# EAGLE board MSP-EXP430FR5994_EagleCAD (EAGLE 7.2.0)
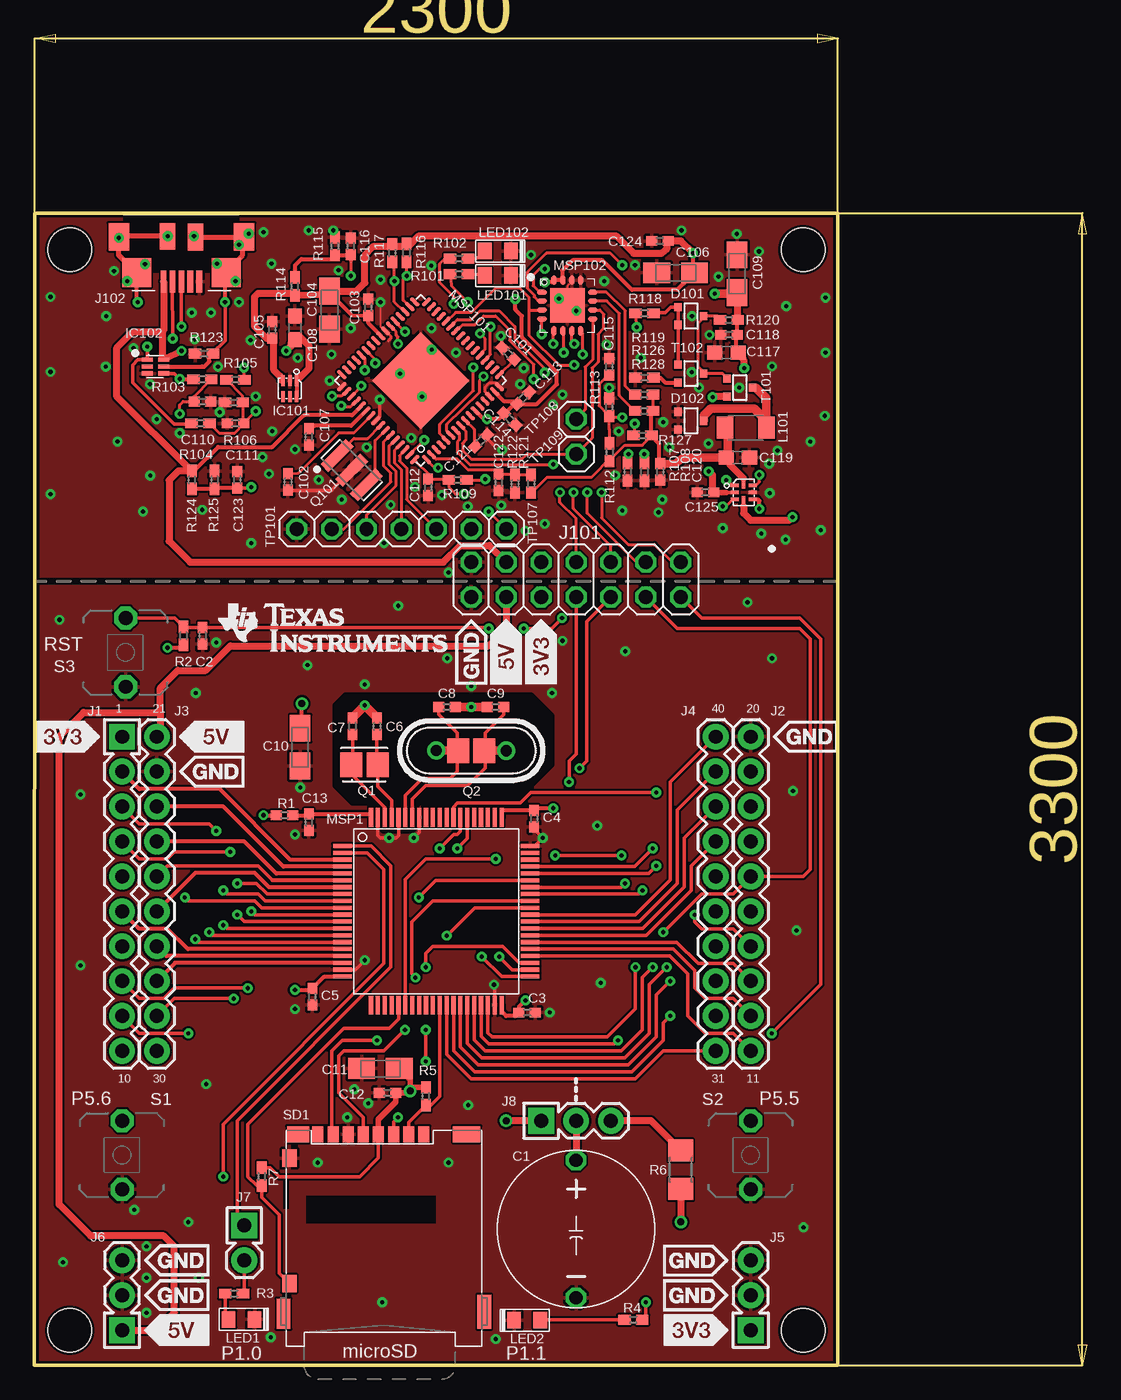
[diagram p7: board, top side]
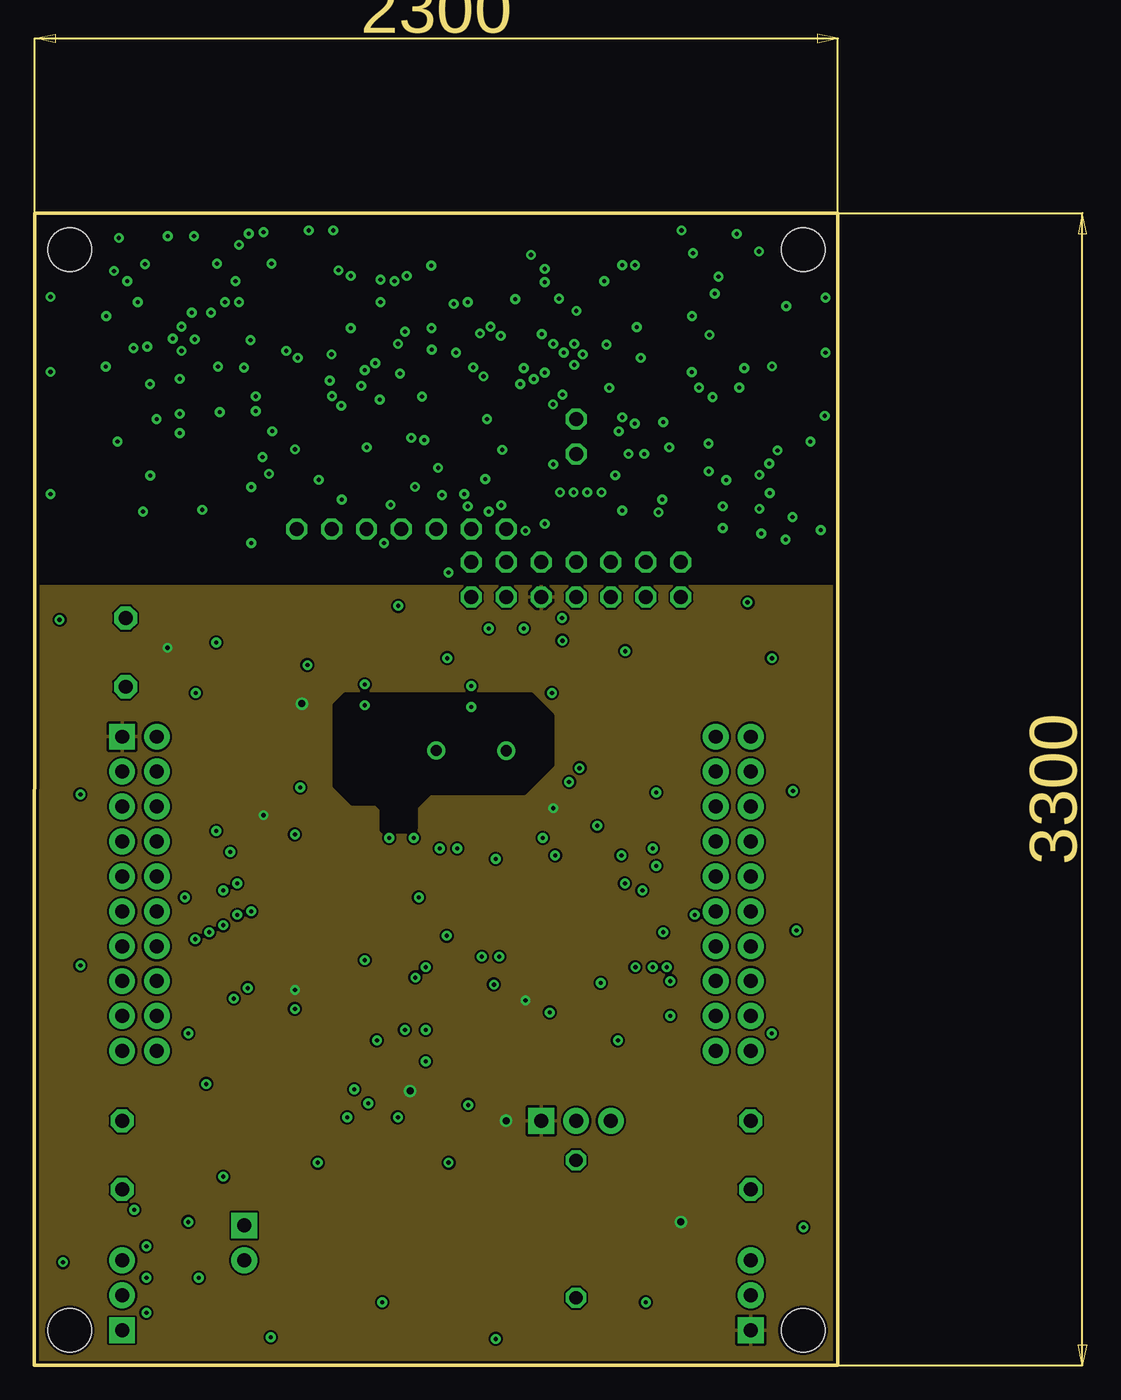
[diagram p8: board, inner layer MidTop]
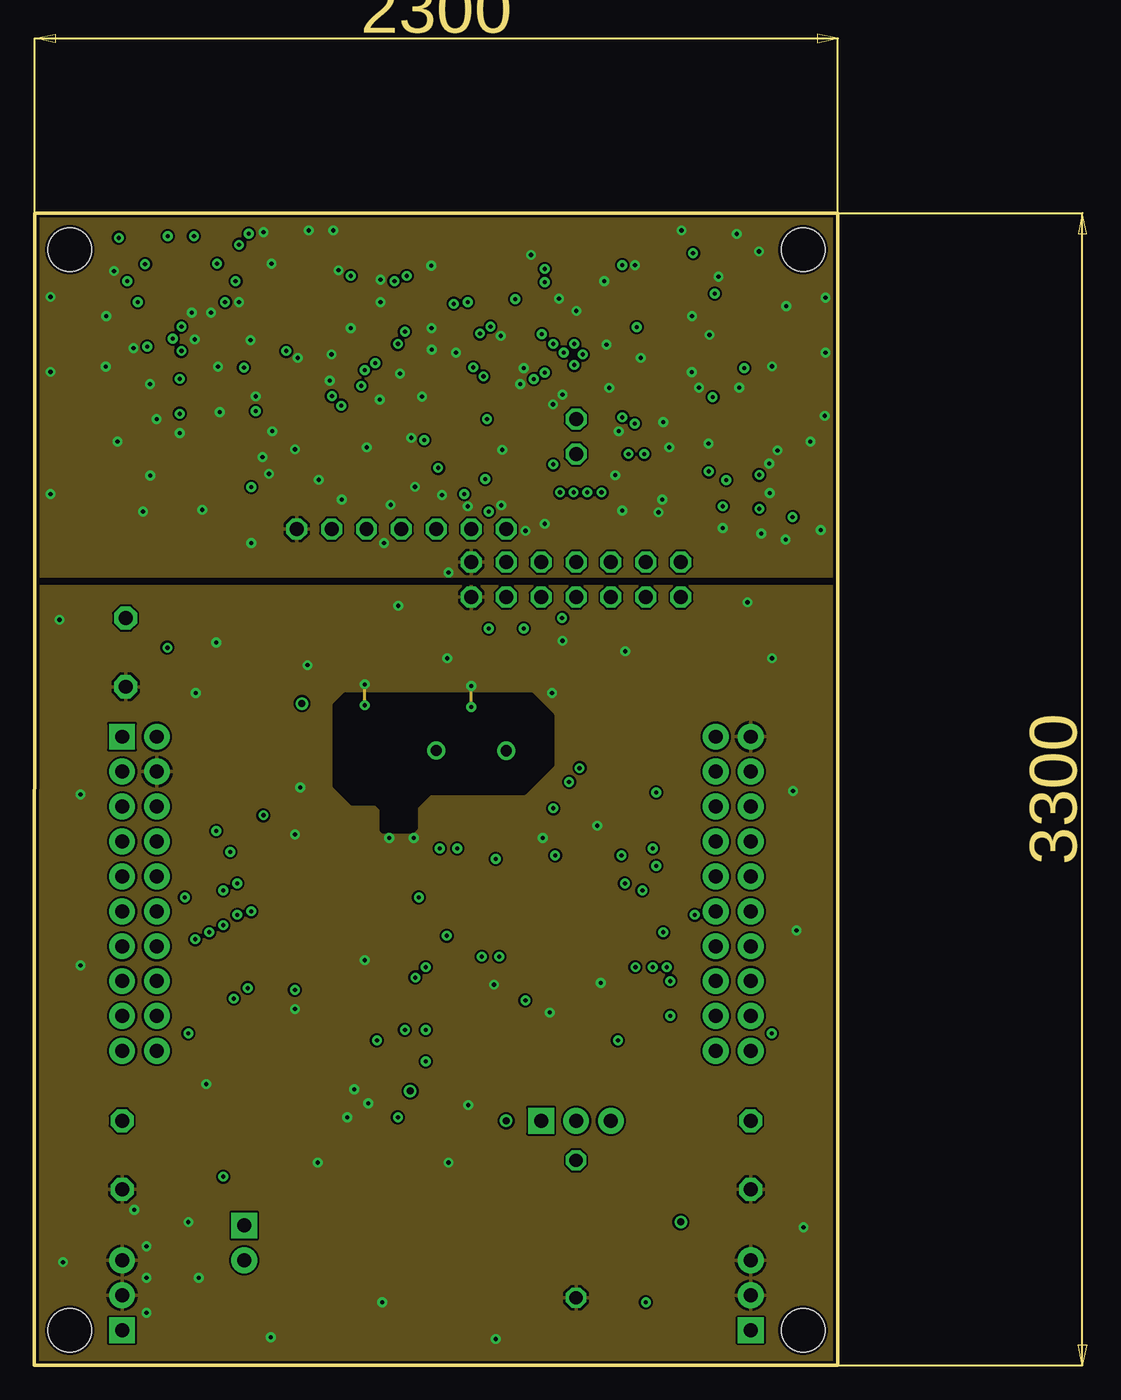
[diagram p9: board, inner layer MidBottom]
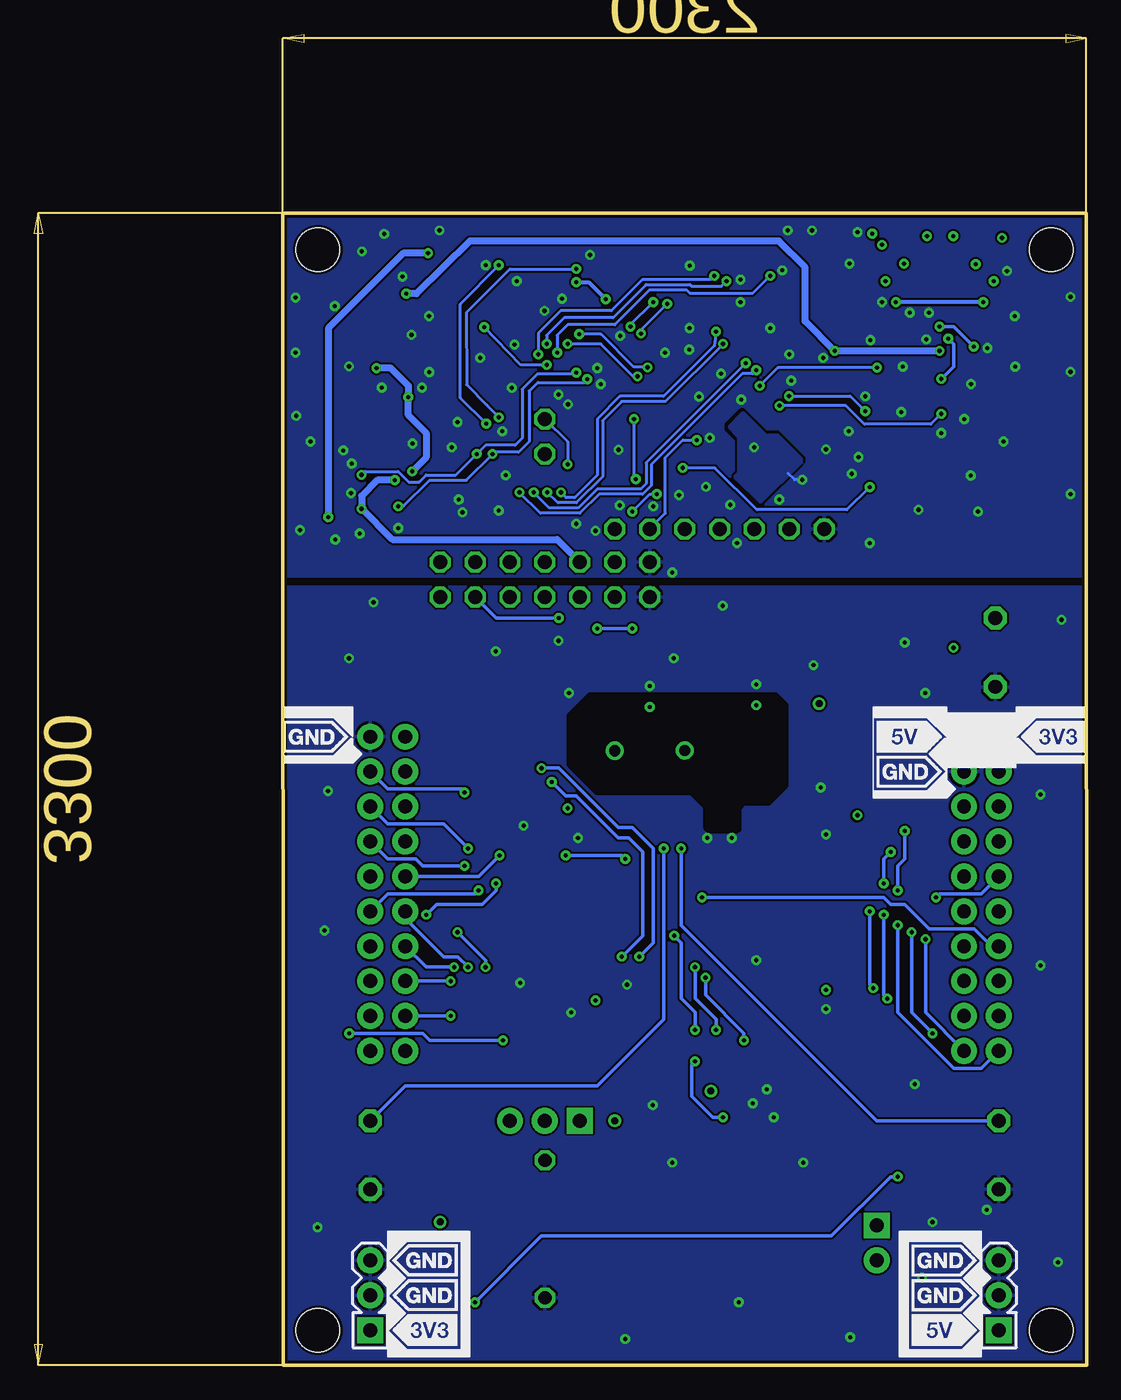
[diagram p10: board, bottom side, seen from below]

Size 58.45 x 83.82 mm. Coordinates in mm from the lower left corner, seen from the top.
Outline: 0,0 58.42,0 58.45,83.82 0.02,83.82 0,0
Copper layers (1+2*15+16): Top 0.0178mm / dielectric 12mil / MidTop 0.0356mm / dielectric 27mil / MidBottom 0.0356mm / dielectric 12mil / Bottom 0.0178mm
Design rules "MSP430 PCBExpress 4-layer-Stein": minimum track width 6mil, minimum drill 12mil, track to track 6mil, track to pad 6mil, pad to pad 6mil, via to via 8mil, smd to smd 6mil, copper to edge 8mil, drill to drill 8mil, minimum pad ring 10mil, minimum via ring 8mil, stop-mask expansion 8mil, vias tented up to drill 15mil, thermal gap 8mil
Net classes: 0 default: width 0.254 mm; 1 Ground: width 0.305 mm, drill 0.305 mm, clearance 0.152 mm to class 0, clearance 0.152 mm; 2 Power: width 0.406 mm, drill 0.305 mm, clearance 0.152 mm to class 0, clearance 0.152 mm to class 1, clearance 0.152 mm
tRestrict: area 20.5,62.5 to 26.3,69.6
bRestrict: area 20.5,62.5 to 26.3,69.6

## Footprints (pad centres in the part's own frame; a part is rotated, then mirrored left to right if it is on the bottom)
PANASONIC_SUPERCAP = drill 0.965 octagon: + 0,5; - 0,-5
0402 = smd 0.8 x 0.7: 1 -0.6,0; 2 0.6,0
A/3216-18R = smd 1.95 x 1.5: + 1.375,0; - -1.375,0
C0603 = smd 1.1 x 1: 1 -0.85,0; 2 0.85,0
SOT323 = smd 0.6 x 0.55: 1 -0.65,-0.825; 2 0.65,-0.825; 3 0,1.025
WSON_DSE = smd 0.25 x 0.8: 1 0,0; 2 0.5,0; 3 1,0; 5 0.5,1.15; 6 0,1.15; P4 1,1.15
SON(DRY)6 = smd 0.81 x 0.305: 1 -0.1,0; 2 -0.1,-0.5; 3 -0.1,-1; 4 1.1,-1; 5 1.1,-0.5; 6 1.1,0
UQFN_RSE = smd 0.25 x 0.58: 1 -0.5,-0.65; 2 0,-0.65; 3 0.5,-0.65; 5 0.5,0.65; 6 0,0.65; 7 -0.5,0.65 | smd 0.58 x 0.25: 4 0.55,0; 8 -0.55,0
J1 = drill 1.016 pad 1.88 square: 1 0,22.86 | drill 1.016 pad 1.88: 2 0,20.32; 3 0,17.78; 4 0,15.24; 5 0,12.7; 6 0,10.16; 7 0,7.62; 8 0,5.08; 9 0,2.54; 10 0,0
J2 = drill 1.016 pad 1.88: 11 0,0; 12 0,2.54; 13 0,5.08; 14 0,7.62; 15 0,10.16; 16 0,12.7; 17 0,15.24; 18 0,17.78; 19 0,20.32; 20 0,22.86
J3 = drill 1.016 pad 1.88: 21 0,22.86; 22 0,20.32; 23 0,17.78; 24 0,15.24; 25 0,12.7; 26 0,10.16; 27 0,7.62; 28 0,5.08; 29 0,2.54; 30 0,0
J4 = drill 1.016 pad 1.88: 31 0,0; 32 0,2.54; 33 0,5.08; 34 0,7.62; 35 0,10.16; 36 0,12.7; 37 0,15.24; 38 0,17.78; 39 0,20.32; 40 0,22.86
3PIN_PWR_3V3 = drill 1.016 pad 1.88 square: 1 0,0 | drill 1.016 pad 1.88: 2 0,2.54; 3 0,5.08
3PIN_PWR_5V = drill 1.016 pad 1.88 square: 1 0,0 | drill 1.016 pad 1.88: 2 0,2.54; 3 0,5.08
1X02 = drill 1.016 pad 1.88 square: 1 -1.27,0 | drill 1.016 pad 1.88: 2 1.27,0
1X03 = drill 1.016 pad 1.88 square: 1 0,0 | drill 1.016 pad 1.88: 2 2.54,0; 3 5.08,0
J101 = drill 1.016 octagon: 1 7.62,1.27; 2 7.62,-1.27; 3 5.08,1.27; 4 5.08,-1.27; 5 2.54,1.27; 6 2.54,-1.27; 7 0,1.27; 8 0,-1.27; 9 -2.54,1.27; 10 -2.54,-1.27; 11 -5.08,1.27; 12 -5.08,-1.27; 13 -7.62,1.27; 14 -7.62,-1.27
EZFET_UX62M-B-5P = smd 0.42 x 1.6: 1 1.3,1.3; 2 0.65,1.3; 3 0,1.3; 4 -0.65,1.3; 5 -1.3,1.3 | smd 2.1 x 2.1: S1 -3.25,0.65; S2 3.25,0.65 | smd 1.5 x 2: S3 -4.55,-1.95; S4 4.55,-1.95 | smd 1.144 x 1.949: S5 -1.016,-1.93; S6 1.016,-1.981
L3216C = smd 1.2 x 1.6: 1 -1.5,0; 2 1.5,0
LED0805 = smd 1 x 1.2: A 1.052,0.102; C -0.848,0.102
PN80 = smd 1.35 x 0.3: 1 -6.825,4.75; 2 -6.825,4.25; 3 -6.825,3.75; 4 -6.825,3.25; 5 -6.825,2.75; 6 -6.825,2.25; 7 -6.825,1.75; 8 -6.825,1.25; 9 -6.825,0.75; 10 -6.825,0.25; 11 -6.825,-0.25; 12 -6.825,-0.75; 13 -6.825,-1.25; 14 -6.825,-1.75; 15 -6.825,-2.25; 16 -6.825,-2.75; 17 -6.825,-3.25; 18 -6.825,-3.75; 19 -6.825,-4.25; 20 -6.825,-4.75; 41 6.825,-4.75; 42 6.825,-4.25; 43 6.825,-3.75; 44 6.825,-3.25; 45 6.825,-2.75; 46 6.825,-2.25; 47 6.825,-1.75; 48 6.825,-1.25; 49 6.825,-0.75; 50 6.825,-0.25; 51 6.825,0.25; 52 6.825,0.75; 53 6.825,1.25; 54 6.825,1.75; 55 6.825,2.25; 56 6.825,2.75; 57 6.825,3.25; 58 6.825,3.75; 59 6.825,4.25; 60 6.825,4.75 | smd 0.3 x 1.35: 21 -4.75,-6.825; 22 -4.25,-6.825; 23 -3.75,-6.825; 24 -3.25,-6.825; 25 -2.75,-6.825; 26 -2.25,-6.825; 27 -1.75,-6.825; 28 -1.25,-6.825; 29 -0.75,-6.825; 30 -0.25,-6.825; 31 0.25,-6.825; 32 0.75,-6.825; 33 1.25,-6.825; 34 1.75,-6.825; 35 2.25,-6.825; 36 2.75,-6.825; 37 3.25,-6.825; 38 3.75,-6.825; 39 4.25,-6.825; 40 4.75,-6.825; 61 4.75,6.825; 62 4.25,6.825; 63 3.75,6.825; 64 3.25,6.825; 65 2.75,6.825; 66 2.25,6.825; 67 1.75,6.825; 68 1.25,6.825; 69 0.75,6.825; 70 0.25,6.825; 71 -0.25,6.825; 72 -0.75,6.825; 73 -1.25,6.825; 74 -1.75,6.825; 75 -2.25,6.825; 76 -2.75,6.825; 77 -3.25,6.825; 78 -3.75,6.825; 79 -4.25,6.825; 80 -4.75,6.825
RGC64 = smd 0.825 x 0.28: 1 -4.36,3.75; 2 -4.36,3.25; 3 -4.36,2.75; 4 -4.36,2.25; 5 -4.36,1.75; 6 -4.36,1.25; 7 -4.36,0.75; 8 -4.36,0.25; 9 -4.36,-0.25; 10 -4.36,-0.75; 11 -4.36,-1.25; 12 -4.36,-1.75; 13 -4.36,-2.25; 14 -4.36,-2.75; 15 -4.36,-3.25; 16 -4.36,-3.75; 33 4.36,-3.75; 34 4.36,-3.25; 35 4.36,-2.75; 36 4.36,-2.25; 37 4.36,-1.75; 38 4.36,-1.25; 39 4.36,-0.75; 40 4.36,-0.25; 41 4.36,0.25; 42 4.36,0.75; 43 4.36,1.25; 44 4.36,1.75; 45 4.36,2.25; 46 4.36,2.75; 47 4.36,3.25; 48 4.36,3.75 | smd 0.28 x 0.825: 17 -3.75,-4.36; 18 -3.25,-4.36; 19 -2.75,-4.36; 20 -2.25,-4.36; 21 -1.75,-4.36; 22 -1.25,-4.36; 23 -0.75,-4.36; 24 -0.25,-4.36; 25 0.25,-4.36; 26 0.75,-4.36; 27 1.25,-4.36; 28 1.75,-4.36; 29 2.25,-4.36; 30 2.75,-4.36; 31 3.25,-4.36; 32 3.75,-4.36; 49 3.75,4.36; 50 3.25,4.36; 51 2.75,4.36; 52 2.25,4.36; 53 1.75,4.36; 54 1.25,4.36; 55 0.75,4.36; 56 0.25,4.36; 57 -0.25,4.36; 58 -0.75,4.36; 59 -1.25,4.36; 60 -1.75,4.36; 61 -2.25,4.36; 62 -2.75,4.36; 63 -3.25,4.36; 64 -3.75,4.36 | smd 5 x 5: TP 0,0
RSA16 = smd 0.7 x 0.35: 1 -1.85,0.975; 2 -1.85,0.325; 3 -1.85,-0.325; 4 -1.85,-0.975; 9 1.85,-0.975; 10 1.85,-0.325; 11 1.85,0.325; 12 1.85,0.975 | smd 0.35 x 0.7: 5 -0.975,-1.85; 6 -0.325,-1.85; 7 0.325,-1.85; 8 0.975,-1.85; 13 0.975,1.85; 14 0.325,1.85; 15 -0.325,1.85; 16 -0.975,1.85 | smd 2.5 x 2.5: TP 0,0
LF_CRYSTAL = smd 1.778 x 1.6: 1 0,0.94; 2 0,-0.965
HF_XTAL = drill 0.813: 1 0.009,2.543; 2 -0.001,-2.533 | smd 1.8 x 1.6: P$1 0,-0.95; P$2 0,0.95
CSTCR4M = smd 0.8 x 2.6: 1 -1.5,0; 2 0,0; 3 1.5,0
0402' = smd 0.9 x 0.7: 1 -0.65,0; 2 0.65,0
R3216 = smd 1.6 x 1.8: 1 -1.4,0; 2 1.4,0
PBTH = drill 1.016 pad 1.676 octagon: 1 -0.001,0.001; 2 5.001,0.001
SD-502702-003 = smd 0.8 x 1.16: 1 -2.9,-17.82; 2 -1.8,-17.82; 3 -0.7,-17.82; 4 0.4,-17.82; 5 1.5,-17.82; 6 2.6,-17.82; 7 3.7,-17.82; 8 4.8,-17.82 | smd 1.05 x 1.25: A 6.885,-16.075; B 6.885,-6.95 | smd 1 x 2.5: P$9 -7.3,-4.9 | smd 1 x 2.2: P$10 7.3,-4.75 | smd 2 x 1.16: P$11 -6.01,-17.82 | smd 1.6 x 1.16: P$12 6.24,-17.82
1X01 = drill 1.016 octagon: 1 0,0
MOUNTHOLE_125MIL = hole 3.175: 0,0

## Placement (x,y rotation side)
C1  0.1F  [PANASONIC_SUPERCAP]  39.4,9.91 0 top
C2  1n  [0402]  12.24,53.07 270 top
C3  100n  [0402]  35.84,25.65 0 top
C4  100n  [0402]  36.35,39.75 270 top
C5  100n  [0402]  20.22,26.8 270 top
C6  22p  [0402]  24.92,46.48 90 top
C7  22p  [0402]  23.14,46.48 90 top
C8  DNP  [0402]  30,47.88 0 top
C9  DNP  [0402]  33.55,47.88 180 top
C10  10u  [A/3216-18R]  19.33,44.96 90 top
C11  1u  [A/3216-18R]  25.17,21.59 0 top
C12  100n  [0402]  25.68,19.81 180 top
C13  100n  [0402]  19.96,39.5 270 top
C101  470n  [0402]  34.46,73.6 135 top
C102  220n  [0402]  18.44,64.26 270 top
C103  100n  [0402]  24.28,76.96 90 top
C104  10u  [A/3216-18R]  21.46,76.76 90 top
C105  100n  [0402]  17.3,75.31 90 top
C106  4.7u  [A/3216-18R]  46.63,79.47 0 top
C107  220n  [0402]  19.96,67.54 270 top
C108  1u  [C0603]  18.95,75.46 90 top
C109  4.7u  [A/3216-18R]  51.11,79.4 270 top
C110  10p  [0402]  12.22,70.1 0 top
C111  10p  [0402]  14.63,68.52 180 top
C112  1n  [0402]  28.63,63.85 270 top
C113  100n  [0402]  35.55,70.36 45 top
C114  100n  [0402]  34.57,68.83 315 top
C115  33p  [0402]  41.81,72.64 270 top
C116  33p  [0402]  23.01,81.41 270 top
C117  4.7u  [C0603]  50.33,73.67 180 top
C118  100n  [0402]  50.51,74.97 180 top
C119  4.7u  [C0603]  51.16,66.03 0 top
C120  100n  [0402]  45.52,64.99 270 top
C121  100n  [0402]  32.48,67.26 45 top
C122  33p  [0402]  33.77,64.21 90 top
C123  33p  [0402]  14.76,64.41 270 top
C124  100n  [0402]  45.49,81.79 180 top
C125  100n  [0402]  48.79,63.5 180 top
D101  BAS40-05  [SOT323]  47.65,76.33 270 top
D102  BAS40-05  [SOT323]  47.65,68.71 270 top
DRAW1  [LOGO-ROCKET-10X7MM-BRD]  2.84,63.13 56 top
DRAW3  [LOGO-ROCKET-10X7MM-BRD]  10.52,15.59 7 top
IC101  [WSON_DSE]  19.07,71.63 180 top
IC102  TPD4E004DRYR  [SON(DRY)6]  8.31,73.15 0 top
IC103  TS5A21366RSER  [UQFN_RSE]  51.59,63.5 270 top
J1  BP_HEADERS_J1  [J1]  6.38,22.86 0 top
J2  BP_HEADERS_J2  [J2]  52.1,22.86 0 top
J3  BP_HEADERS_J3  [J3]  8.91,22.86 0 top
J4  BP_HEADERS_J4  [J4]  49.55,22.86 0 top
J5  HEADER 1X03  [3PIN_PWR_3V3]  52.1,2.54 0 bottom
J6  BP_HEADERS_PWR_5V  [3PIN_PWR_5V]  6.38,2.54 0 bottom
J7  JUMPER1X02  [1X02]  15.27,8.89 270 top
J8  JUMPER1X03  [1X03]  36.86,17.78 0 top
J101  J101_2X7_HEADER  [J101]  39.4,57.15 0 top
J102  Micro-USB  [EZFET_UX62M-B-5P]  10.69,80.14 180 top
L101  2u2  [L3216C]  51.73,68.19 180 top
LED1  Red  [LED0805]  15.16,3.43 180 top
LED2  Green  [LED0805]  35.74,3.17 0 top
LED101  Red  [LED0805]  33.81,79.38 180 top
LED102  Green  [LED0805]  33.81,81.15 180 top
MSP1  MSP430FR5994  [PN80]  29.23,33.02 0 top
MSP101  MSP430F5528IRGC  [RGC64]  28.09,71.63 135 top
MSP102  MSP430G2452IRSA16R  [RSA16]  38.76,77.09 0 top
Q1  LF_CRYSTAL  [LF_CRYSTAL]  24.03,43.69 270 top
Q2  [HF_XTAL]  31.78,44.7 90 top
Q101  PIEZO_CSTCR4M00G15L99  [CSTCR4M]  23.08,65.11 315 top
R1  0R  [0402]  18.19,40.01 0 top
R2  47k  [0402']  10.84,53.07 270 top
R3  470  [0402']  14.53,5.21 180 top
R4  390  [0402']  43.56,3.3 180 top
R5  DNP- 47k  [0402']  28.47,19.56 90 top
R6  22  [R3216]  47.02,14.22 90 top
R7  DNP- 100k  [0402']  16.54,13.72 270 top
R101  470  [0402']  30.89,79.38 180 top
R102  390  [0402']  30.89,80.5 180 top
R103  27  [0402']  12.22,71.72 0 top
R104  27  [0402']  12.09,68.52 0 top
R105  1k4  [0402']  14.63,71.69 0 top
R106  1M  [0402']  14.5,70.04 180 top
R107  47k  [0402']  43.15,65 270 top
R108  47k  [0402']  44.37,65 270 top
R109  47k  [0402']  30.79,64.4 0 top
R112  220k  [0402']  41.84,66.42 90 top
R113  220k  [0402']  41.81,69.7 90 top
R114  220k  [0402']  18.95,78.49 90 top
R115  220k  [0402']  21.87,81.41 90 top
R116  4k7  [0402']  27.06,80.91 270 top
R117  4k7  [0402']  26.03,80.91 270 top
R118  820  [0402']  44.37,76.52 180 top
R119  0  [0402']  44.37,71.84 180 top
R120  470  [0402']  50.51,76.03 180 top
R121  220k  [0402']  36.13,64.14 90 top
R122  220k  [0402']  34.95,64.14 270 top
R123  33k  [0402']  12.34,73.6 180 top
R124  240k  [0402']  11.46,64.41 270 top
R125  150k  [0402']  13.11,64.41 90 top
R126  2k2  [0402']  44.35,70.61 180 top
R127  3k3  [0402']  44.22,67.64 180 top
R128  6k8  [0402']  44.35,69.42 180 top
S1  [PBTH]  6.38,17.78 270 top
S2  [PBTH]  52.1,17.78 270 top
S3  [PBTH]  6.63,54.36 270 top
SD1  SD-502702-003-1  [SD-502702-003]  25.43,-1.02 180 top
T101  DMG1013UW  [SOT323]  51.21,71.12 270 top
T102  BC850CW-115  [SOT323]  47.65,72.14 270 top
TP101  TEST_PIN2  [1X01]  19.08,60.83 0 top
TP102  TEST_PIN2  [1X01]  21.62,60.83 0 top
TP103  TEST_PIN2  [1X01]  24.15,60.83 0 top
TP104  TEST_PIN2  [1X01]  26.7,60.83 0 top
TP105  TEST_PIN2  [1X01]  29.23,60.83 0 top
TP106  TEST_PIN2  [1X01]  31.78,60.83 0 top
TP107  TEST_PIN2  [1X01]  34.32,60.83 0 top
TP108  TEST_PIN2  [1X01]  39.39,68.83 0 top
TP109  TEST_PIN2  [1X01]  39.4,66.29 0 top
U$1  FR5994_REARSILK_REV1_0  [FR5994_REARSILK_REV1_0]  0.02,0 0 top
U$2  MOUNTHOLE_125MIL  [MOUNTHOLE_125MIL]  2.56,2.54 0 top
U$3  MOUNTHOLE_125MIL  [MOUNTHOLE_125MIL]  2.56,81.15 0 top
U$4  [LOGO16_TPLACE]  13.28,51.73 0 top
U$5  MOUNTHOLE_125MIL  [MOUNTHOLE_125MIL]  55.91,2.54 0 top
U$6  MOUNTHOLE_125MIL  [MOUNTHOLE_125MIL]  55.91,81.15 0 top
U$7  MIKE_TM  [MIKE_TM]  25.17,8.13 0 top
U$8  BP_3PIN_SILK  [3PIN_PWR_SILK]  7.65,0.61 0 top
U$10  BP_3PIN_SILK_RT  [3PIN_PWR_SILK_RT]  50.83,0.61 0 top

## Tracks (layer width: path | path; a pad name or v marks a point on that pad's centre or on a via)
!RST!/SBWTDIO  (via drill 0.3)
  Top 0.203: R2.1 10.89,53.67
  Top 0.254: R2.1 10.2,54.36 S3.1 | 10.89,53.67 C2.1 32.97,53.67 v33.05,53.59 | v35.59,53.59 37.62,53.59 v38.38,54.36 | J101.4 46.76,53.59 55.65,53.59 56.41,52.83 56.41,36.07 55.91,35.56 J2.16 50.83,34.29 48.54,34.29 v45.75,31.5 | MSP1.38 32.98,24.19 33.3,23.88 41.68,23.88 43.71,25.91 v43.71,28.96
  Bottom 0.254: v33.05,53.59 v35.59,53.59 | v38.38,54.36 42.95,54.36 J101.4 | v43.71,28.96 43.71,29.46 v45.75,31.5
+3V3  (via drill 0.3, 0.51)
  Top 0.203: 10.84,52.35 R2.2
  Top 0.254: SD1.4 25.02,15.09 23.65,13.72 17.8,13.72 17.15,14.37 R7.1
  Top 0.305: v9.68,52.2 10.62,52.2 R2.2 | 33.98,25.91 MSP1.40 33.98,25.73 34.32,25.4 34.98,25.4 C3.1 35.24,26.07 v35.71,26.54 | v18.95,27.3 20.22,27.3 C5.1 21.09,28.27 MSP1.20 | MSP1.61 33.98,40.35 C4.1 36.35,40.51 v37.74,40.51 | v16.66,40.01 R1.1 | C10.+ 19.46,46.33 v19.46,48.13
  Top 0.406: J1.1 6.38,45.64 | R5.2 27.6,20.21 v27.33,19.94 | SD1.4 25.02,17.89 26.28,19.14 C12.1 27.2,19.81 v27.33,19.94 | 27.33,20.28 v27.33,19.94 | C11.+ 27.33,20.81 v27.33,19.94
  Top 0.508: R6.1 v47.02,10.41 | J8.1 v34.32,17.78
  pour MidTop: 0.02,56.64 0.02,0 58.45,0 58.45,56.64
+5V
  Top 0.508: J101.12 34.32,53.59 33.05,52.32 14.25,52.32 12.47,50.55 10.44,50.55 9.17,49.28 9.17,47.5 | J6.1 8.91,2.54 10.18,3.81 10.18,8.64 9.42,9.4 4.09,9.4 1.8,11.68 1.8,45.72 3.58,47.5 9.17,47.5 | 9.17,47.5 9.17,45.97 J3.21
EZFET_AVBUS  (via drill 0.3)
  Top 0.203: v29.36,65.28 29.11,65.28 28.52,65.86 MSP101.1
  Top 0.254: C123.2 15.71,63.81 v15.77,63.88
  Top 0.305: 12.96,63.86 12.98,63.88 13.12,63.88 | 13.11,63.86 R125.1 | 13.23,63.88 13.12,63.88 | 13.12,63.88 R125.1 | R124.2 R125.1 | R125.1 | C123.2 13.16,63.81 R125.1
  Bottom 0.203: v29.36,65.28 27.02,65.28 23.98,62.23 17.42,62.23 v15.77,63.88
EZFET_AVCC  (via drill 0.3)
  Top 0.152: 38.51,75.17 38.51,75.18 MSP102.6
  Top 0.203: 23.01,80.38 v23.01,79.25 | v38.51,73.66 38.51,75.17
  Top 0.305: 23.01,80.38 C116.2 | 22.97,80.48 23.01,80.52 23.01,80.48 | 23.01,80.39 23.01,80.48 | 23.01,80.48 C116.2 | R114.2 18.95,79.04 18.95,80.01 19.41,80.48 21.59,80.48 R115.1 22.96,80.76 C116.2
  Bottom 0.203: v23.01,79.25 24.28,77.98 28.85,77.98 29.11,78.23 31.78,78.23 34.32,75.69 37.74,75.69 38.51,74.93 v38.51,73.66
EZFET_AVCCOUT  (via drill 0.3)
  Top 0.152: 36.73,78.11 36.86,78.11 MSP102.1
  Top 0.203: R113.1 41.81,68.08 41.81,68.07 41.81,67.06 41.83,67.06 R112.2 | R113.1 42.03,68.96 v42.75,68.96 | 36.73,78.11 36.27,78.54 36.27,79.3 36.73,79.76 v37.11,79.76 | 41.78,72.06 41.78,72.03 41.83,71.98 41.83,71.99 41.86,72.01 | 41.86,71.92 41.86,72.01 | 41.86,72.01 41.86,72.04 41.83,72.06 | C115.2 41.79,72.09 41.07,71.37 41.07,69.8 41.68,69.19 41.77,68.94 R113.1
  Top 0.508: C115.2 41.81,72.08 41.78,72.06
  Bottom 0.203: v37.11,79.76 41.94,79.76 45.11,76.58 45.09,71.32 43.61,69.85 v42.75,68.96
EZFET_AVCCOUT2ADC
  Top 0.203: MSP101.2 29.21,65.91 30.76,65.91 31.52,65.15 33.43,65.15 C122.2 34.92,64.81 R122.1 R121.2 | R121.2
EZFET_DCDCCAL0
  Top 0.203: R126.2 43.7,70.48 43.33,70.87 42.98,71.22 42.98,76.71 41.6,78.06 MSP102.12
EZFET_DCDCCAL1  (via drill 0.3)
  Top 0.203: MSP102.2 36.85,77.47 36.6,77.47 36.35,77.72 36.35,77.85 35.84,78.36 35.84,79.5 37.24,80.9 41.88,80.9 v42.75,80.03 | R127.2 43.67,67.61 43.66,67.97 43.66,68.43 43.69,68.45 43.66,68.45 v43.66,68.5
  Bottom 0.203: v42.75,80.03 45.54,77.19 45.54,70.36 v43.66,68.5
EZFET_DCDCCAL2
  Top 0.203: MSP102.11 40.63,77.42 41.63,77.42 42.55,76.5 42.55,70.55 43.67,69.42 R128.2
EZFET_DCDCIO0  (via drill 0.3)
  Top 0.203: v36.91,75.01 36.91,75.24 MSP102.4 | v31.93,72.59 31.93,70.89 29.49,68.45 29.49,67.76 MSP101.5
  Bottom 0.203: v36.91,75.01 35.31,75.01 32.92,72.62 32.16,72.62 v31.93,72.59
EZFET_DCDCIO1  (via drill 0.3)
  Top 0.203: 30.12,67.83 MSP101.6 30,67.96 30,68.45 32.35,70.75 32.36,70.77 32.36,71.63 v32.66,71.93 | v37.74,74.3 37.74,75.2 MSP102.5
  Bottom 0.203: v37.74,74.3 35.33,74.3 32.97,71.93 v32.66,71.93
EZFET_DCDCPULSE  (via drill 0.3)
  Top 0.203: R118.2 43.82,75.81 v43.82,75.51 | v39.27,72.77 38.18,72.77 35.97,74.93 35.97,76.84 | 35.97,76.84 35.97,77.7 35.31,78.36 33.55,78.36 31.78,76.58 30.63,76.58 30,75.95 MSP101.28 | 35.97,76.84 36.04,76.76 MSP102.3
  Bottom 0.203: v39.27,72.77 41.15,72.77 v43.82,75.51
EZFET_DCDCRST  (via drill 0.3)
  Top 0.203: MSP101.7 30.66,67.99 30.91,67.74 30.91,67.33 30.76,67.18 30.76,66.42 31.65,65.53 v37.74,65.53 | 40.78,76.07 MSP102.9 40.61,73.17 40.05,72.62 40.05,69.52 TP108.1 | TP108.1 39.42,68.86 39.37,68.91 TP108.1
  Top 0.305: TP108.1
  Bottom 0.203: TP108.1 | TP108.1 37.74,67.18 v37.74,65.53
EZFET_DCDCTEST
  Top 0.203: MSP101.8 31,68.34 31.37,67.97 31.37,67.28 31.14,67.06 31.14,66.55 31.78,65.91 35.46,65.91 35.84,66.29 TP109.1 39.8,66.7 40.56,67.46 40.56,72.54 41,72.97 41,75.01 41.43,75.44 41.43,76.45 41.12,76.76 40.74,76.76 40.66,76.83 40.66,76.71 MSP102.10
EZFET_DM  (via drill 0.3)
  Top 0.203: J102.2 10.04,78.75
  Top 0.254: IC102.4 10.17,72.15 v10.57,71.75 | 10.04,78.75 v10.06,74.68
  Top 0.305: v10.57,71.75 11.58,71.75 11.61,71.72 R103.1
  Bottom 0.254: v10.57,71.75 9.68,72.64 9.68,74.3 v10.06,74.68
EZFET_DP  (via drill 0.3)
  Top 0.254: v8.2,74.09 v8.21,74.1 IC102.1 7.52,73.15 7.14,72.77 7.14,71.5 10.18,68.45 11.5,68.45 R104.1 | J102.3 v10.69,75.56
  Bottom 0.254: v10.69,75.56 9.68,75.56 v8.2,74.09
EZFET_HOSTSCL  (via drill 0.3)
  Top 0.152: MSP101.35 26.95,76.71 26.95,76.7
  Top 0.203: 26.95,76.7 26.83,76.7 26.19,77.34 v26.19,78.87 26.19,80.34 | v39.27,74.3 39.09,74.45 MSP102.7
  Top 0.305: 26.19,80.34 R117.2
  Bottom 0.203: v26.19,78.87 26.57,78.49 28.73,78.49 28.85,78.61 32.03,78.61 34.44,76.2 38,76.2 39.27,74.93 v39.27,74.3
EZFET_HOSTSDA  (via drill 0.3)
  Top 0.203: MSP101.34 27.28,77.01 26.82,77.47 26.82,78.99 v27.08,79.25 27.08,80.25 R116.2 | MSP102.8 39.88,75.07 v39.88,73.53
  Bottom 0.203: v27.08,79.25 27.33,78.99 32.28,78.99 34.57,76.71 38.25,76.71 39.88,75.08 v39.88,73.53
EZFET_LED0  (via drill 0.3)
  Top 0.203: MSP101.20 33.17,73.53 v33.17,75.56 | v31.52,77.34 30.34,78.53 R101.2
  Bottom 0.203: v33.17,75.56 33.17,75.69 v31.52,77.34
EZFET_LED1  (via drill 0.3)
  Top 0.203: 30.23,80.38 R102.2 29.85,80.5 29.49,80.14 29.49,78.74 30.5,77.72 v30.5,77.22 | MSP101.21 32.41,73.54 32.79,73.91 32.79,74.68 v32.41,75.06
  Bottom 0.203: v32.41,75.06 32.41,75.31 v30.5,77.22
EZFET_PU.0/DP  (via drill 0.3)
  Top 0.152: 22.76,70.87 MSP101.50
  Top 0.203: v16.1,69.42 15.33,68.64 C111.1 | R104.2 13.39,67.87 13.46,67.79 14.56,67.79 C111.1 | 15.15,68.44 C111.1 | 22.76,70.87 22.5,70.61 22.45,70.61 22.35,70.51 v21.64,70.51 | 15.18,68.62 C111.1 | R105.1 15.15,70.52 R106.1 15.15,68.59 C111.1
  Bottom 0.203: v16.1,69.42 17.2,70.51 v21.64,70.51
EZFET_PU.1/DM  (via drill 0.3)
  Top 0.203: 12.74,71.66 R103.2 11.62,70.47 C110.1 10.82,70.1 10.57,69.85 v10.57,69.22 | MSP101.52 23,69.72 22.5,69.72 v22.33,69.8
  Bottom 0.203: v22.33,69.8 17.5,69.8 16.15,68.45 11.33,68.45 v10.57,69.22
EZFET_PUR  (via drill 0.3)
  Top 0.203: MSP101.51 23.52,70.94 v23.77,71.25 | v15.24,72.57 15.25,71.79 R105.2
  Bottom 0.203: v15.24,72.57 22.45,72.57 v23.77,71.25
EZFET_RST  (via drill 0.3)
  Top 0.203: MSP101.64 27.79,65.71 28.63,64.86 C112.1 | 28.6,64.47 C112.1 | C112.1 30.09,64.45 R109.1 30.14,63.87 30.63,63.37 v31.27,63.37 | TP107.1 | TP107.1 v33.05,62.1
  Bottom 0.203: v33.05,62.1 31.78,63.37 v31.27,63.37
EZFET_SBWTCK  (via drill 0.3)
  Top 0.203: MSP101.44 23.75,73.48 24.03,73.2 v24.03,72.39 | v41.25,63.5 41.25,61.65 43.18,59.72 45.09,59.72 46.38,58.42 J101.1
  Bottom 0.203: v24.03,72.39 24.28,72.14 25.04,72.14 31.65,65.53 31.65,64.01 32.28,63.37 35.46,63.37 36.86,61.98 39.73,61.98 v41.25,63.5
EZFET_SBWTDIO  (via drill 0.3)
  Top 0.203: MSP101.43 24.12,73.82 24.79,73.15 v24.79,72.9 | J101.3 43.79,58.42 42.55,59.66 42.52,59.66 40.21,61.98 v40.21,63.5
  Bottom 0.203: v24.79,72.9 32.03,65.66 32.03,64.14 32.41,63.75 35.59,63.75 36.98,62.36 39.07,62.36 v40.21,63.5
EZFET_SHIELD  (via drill 0.3)
  Top 0.152: 14,79.12 13.87,78.99 13.87,78.87
  Top 0.203: 7.44,77.22 7.52,77.22 v7.52,77.34 | 7.44,78.87 7.39,78.87 | 7.39,78.87 7.39,79.38 | v6.76,78.87 7.39,78.87 | v14.63,78.87 13.87,78.87
  Top 0.254: R123.1 12.91,73.6 13.87,74.55 v13.87,77.34
  Top 0.305: IC102.5 12.21,72.65 12.34,72.64 12.73,73.03 12.73,73.43 R123.1 12.73,73.33 | 7.44,77.22 7.44,78.87 | v13.87,77.34 13.87,78.87
  Top 0.381: J102.S2 7.41,79.49 6.12,80.77 6.12,82.04 6.14,82.06 J102.S4 | J102.S4 v6.14,82.02 v6.15,82.02 | 14,79.12 14,79.54 | J102.S2 7.44,79.43 7.39,79.38 | v8.05,80.11 8.05,80.09 J102.S2 | v13.28,80.14 v13.29,80.14 J102.S1 14,79.54 | 14,79.54 14,79.63 15.14,80.77 15.14,81.25 v14.88,81.51 14.88,81.73 J102.S3 | v15.59,82.32 15.59,82.06 J102.S3 | J102.S3 15.22,82.07 J102.S5 11.68,82.07 v11.61,82.14 | 9.68,82.14 6.2,82.14 J102.S4
  Top 0.406: J102.S6 9.68,82.14 v9.7,82.14
  Bottom 0.305: v7.52,77.34 v13.87,77.34
EZFET_TCK  (via drill 0.3)
  Top 0.203: v28.35,67.31 27.31,66.27 MSP101.63
  Bottom 0.203: TP106.1 | v28.35,67.31 29.36,67.31 30.63,66.04 30.63,61.98 TP106.1 | TP106.1
EZFET_TDI
  Top 0.203: MSP101.61 26.59,66.95 26.19,66.55 26.19,65.66 26.7,65.15 TP104.1 | TP104.1
EZFET_TDO
  Top 0.203: TP103.1 24.15,61.85 26.31,64.01 26.31,65.02 25.81,65.53 25.81,66.87 MSP101.60
EZFET_TEST
  Top 0.203: 25.93,67.69 25.92,67.69 MSP101.59 25.43,67.19 25.43,65.41 25.93,64.9 25.93,64.26 22.5,60.83 TP102.1
EZFET_TMS
  Top 0.203: MSP101.62 26.95,66.55 26.57,66.17 26.57,65.79 27.08,65.28 27.08,62.99 TP105.1
EZFET_UARTRXD  (via drill 0.3)
  Top 0.203: MSP101.38 26.31,75.18 26.31,74.93 26.44,74.8 v26.44,74.3 | J101.5 41.94,59.59 39.19,62.33 39.19,63.48 v39.22,63.5
  Bottom 0.203: v26.44,74.3 30.63,70.1 33.81,70.1 35.2,68.71 35.2,64.64 37.11,62.74 38.46,62.74 v39.22,63.5
EZFET_UARTTXD  (via drill 0.3)
  Top 0.203: MSP101.37 26.25,75.89 v26.95,75.18 | v38.23,63.5 38.23,62.76 39.4,61.59 J101.7
  Bottom 0.203: v26.95,75.18 27.08,74.17 30.76,70.48 33.93,70.48 35.59,68.83 35.59,64.77 37.24,63.12 37.85,63.12 v38.23,63.5
EZFET_V18
  Top 0.203: MSP101.55 24.45,69.05 23.21,67.82 22.12,67.82 19.22,64.91 C102.1
EZFET_VBUS  (via drill 0.3)
  Top 0.203: 9.3,73.28 9.3,73.15 IC102.6 | 9.55,73.28 IC102.6 | IC102.6 | 51.1,77.75 51.1,78.02 C109.+
  Top 0.254: IC103.2 50.32,63.5
  Top 0.305: MSP101.53 23.11,69.11 19.61,69.11 17.3,66.8 13.36,66.8 11.71,65.15 11.33,65.15 | 19.33,71.88 IC101.1 IC101.6 | 51.06,73.75 51.06,74.92 C118.1 51.11,75.99 R120.1
  Top 0.406: 50.32,63.5 C125.1 49.3,63.5
  Top 0.508: 9.3,75.18 9.3,73.28 | 9.55,73.28 v10.69,73.79 | 9.3,75.18 7.14,75.18 5.99,74.04 5.99,70.46 11.33,65.15 11.45,64.97 R124.1 10.48,65.06 9.8,64.39 9.8,59.94 11.33,58.42 29.74,58.42 30.96,59.64 33.1,59.64 J101.11 | v18.31,73.79 18.69,74.17 18.69,74.42 19.07,74.8 19.04,74.8 C108.1 19.37,74.76 19.96,74.17 19.96,72.52 19.33,71.88 | J102.1 9.39,75.28 9.3,75.18 | 51.1,77.75 51.1,76.1 51.06,76.05 R120.1 | 51.06,74.97 C118.1 | 51.06,73.75 C117.1 51.03,73.71 51.59,73.15 51.59,72.52 51.61,72.52 v51.64,72.54 | T101.2 49.32,70.47 | 49.32,70.47 49.3,70.48 | v49.33,70.43 49.33,70.46 49.32,70.47 | v49.05,65.02 49.3,64.77 49.3,63.54 C125.1
  Top 0.635: C109.+ 50.62,77.97 50.39,77.95 v49.48,77.95
  Bottom 0.305: 48.87,77.9 48.74,77.95
  Bottom 0.508: v10.69,73.79 v18.31,73.79 20.47,75.95 20.47,79.88 22.38,81.79 44.86,81.79 48.74,77.95 v49.48,77.95 | v51.64,72.54 50.62,72.54 49.33,71.25 v49.33,70.43 49.33,69.11 48.03,67.82 48.03,66.04 v49.05,65.02
EZFET_VCC  (via drill 0.3)
  Top 0.152: MSP101.11 32.03,69.47 32.07,69.43 | 33.86,68.89 C114.1 | 33.43,70.87 MSP101.15
  Top 0.203: 24.66,75.41 MSP101.40 | R116.1 27.08,81.53 | C114.1 34.06,69.22 | 33.86,68.89 34.12,69.15 | 34.95,76.83 34.98,76.86 | R109.2 32.6,64.4 v32.79,64.47
  Top 0.254: 17.93,71.63 IC101.3 | IC103.4 51.59,62.48 | C103.1 23.1,76.36 23.05,76.41
  Top 0.305: MSP101.40 25.19,74.92 24.28,75.82 C103.1 | 25.52,81.44 R117.1 25.44,81.41 | 46.17,81.82 C124.1 46.04,81.3 45.99,81.19 | 48.14,79.81 C106.+ | 43.59,80.9 45.69,80.9 45.99,81.19 | 38.42,78.92 38.38,79.12 38.38,79.63 39.14,80.39 41.3,80.39 43.46,78.23 46.76,78.23 47.55,79.03 C106.+ | 38.42,78.92 38.43,78.84 | 33.6,70.71 MSP101.15 | 32.07,69.43 32.66,68.83 v32.92,68.83 33.76,68.83 34.12,69.15 35.08,70.1 | v37.11,78.79 37.64,78.79 MSP102.16 MSP102.15 38.42,78.92 | C106.+ 47.73,79.47 47.9,79.68 v47.9,80.9 | 46.06,81.14 45.99,81.19 | 35.08,70.1 35.38,69.93 36.55,69.93 38,71.37 38,72.26 35.46,74.8 35.46,76.33 34.98,76.81 34.98,76.86 v34.98,77.55 | 35.08,70.1 35.14,70.1 C113.1 | 35.08,70.1 34.19,70.1 33.43,70.87 | 23.05,76.41 21.49,77.98 21.49,78.1 C104.+
  Top 0.406: 17.85,71.97 17.93,71.84 17.93,71.63 | 17.42,74.55 17.3,74.55 C105.1 16.88,74.71
  Top 0.508: 16.88,74.71 16.03,75.56 16.03,77.72 16.28,77.98 18.91,77.98 R114.1 21.26,77.94 C104.+ 23.42,78.13 24.03,78.74 24.03,80.77 24.66,81.41 25.44,81.41 27,81.41 R116.1 27.26,81.47 27.96,82.17 42.32,82.17 43.59,80.9 45.62,80.9 46.02,81.23 46.02,81.74 | 17.85,71.97 17.42,72.39 17.42,74.55 17.34,74.76 17.35,74.76 | v47.9,80.9 47.02,81.79 C124.1 | v55.14,61.7 55.14,61.72 54.89,61.47 52.1,61.47 51.59,61.98 51.59,62.48
  Bottom 0.203: v32.92,68.83 32.92,64.59 v32.79,64.47
  Bottom 0.305: v37.11,78.79 36.22,78.79 v34.98,77.55
  Bottom 0.508: v47.9,80.9 49.68,80.9 55.14,75.44 v55.14,61.7
EZFET_VCCEN1  (via drill 0.3)
  Top 0.203: MSP101.26 30.69,75.24 31.14,75.69 32.03,75.69 32.66,76.33 33.55,76.33 34.57,75.31 34.57,74.55 36.32,72.8 v36.32,71.73 | v50.06,62.48 50.32,62.48 50.83,63 IC103.3 | R107.1 43.15,65.97 v43.21,66.29
  Bottom 0.203: v50.06,62.48 49.68,62.48 47.78,64.39 45.11,64.39 v43.21,66.29 43.08,66.42 41.3,66.42 40.54,67.18 40.54,70.87 39.9,71.5 36.55,71.5 v36.32,71.73
EZFET_VCCEN2  (via drill 0.3)
  Top 0.203: MSP101.27 30.76,76.07 31.78,76.07 32.41,76.71 33.81,76.71 34.95,75.56 34.95,74.68 37.11,72.52 v37.11,72.21 | R108.1 v44.35,66.29 | IC103.7 52.47,64 52.73,64.26 v52.73,64.77
  Bottom 0.203: v52.73,64.77 52.48,65.02 50.06,65.02 49.3,64.26 48.54,64.26 48.03,64.77 45.87,64.77 v44.35,66.29 43.71,66.93 41.55,66.93 41.05,67.44 41.05,70.99 39.9,72.14 37.19,72.14 v37.11,72.21
EZFET_VCCOUT
  Top 0.203: 41.81,65.9 40.69,64.77 40.5,64.58 37.27,64.58 36.18,63.48 R121.1 | 41.81,65.9 41.81,65.91 41.94,65.91 42.95,66.93 44.22,66.93 44.73,67.44 44.73,67.47 R127.1 | 41.81,65.9 R112.1 | R128.1 R126.1
  Top 0.254: 51.59,64.52 IC103.8
  Top 0.305: C120.1 45.4,65.54 45.4,67.06 R127.1 44.87,69.29 R128.1 | 46.62,65.57 46.62,65.54
  Top 0.508: 50.55,66.02 50.55,65.56 51.59,64.52
  Top 0.635: 46.62,65.57 47.19,66.02 50.43,66.02 C119.1 50.46,65.99 50.47,65.99 | L101.2 50.44,67.91 50.44,66.27 50.42,66.27 50.42,66.17 50.55,66.17 50.55,66.02 50.47,66.02 50.47,65.99 | 50.47,65.96 50.47,65.99 | 46.62,65.54 C120.1
EZFET_VCCTARGET  (via drill 0.3)
  Top 0.254: IC103.5 52.21,63
  Top 0.305: IC103.1 50.71,64 v50.32,64.39 | 52.21,63 52.6,63 52.73,62.87 v52.73,62.31
  Bottom 0.508: v50.32,64.39 51.59,64.39 52.73,63.25 v52.73,62.31 50.5,60.07 38.51,60.07 J101.9
EZFET_VCORE
  Top 0.203: MSP101.17 34.93,73.16 C101.1
EZFET_VREF
  Top 0.203: C121.1 31.98,66.84 31.98,68.1 MSP101.9
EZFET_VUSB
  Top 0.305: MSP101.54 23.04,68.34 20.36,68.34 20.09,68.07 | C107.1 20.09,68.07 | 20.09,68.07
EZFET_XT2IN
  Top 0.203: MSP101.57 25.16,68.37 24.23,67.41 23.24,67.41 22.06,66.23 22,66.17
  Top 0.406: Q101.1 22.06,66.17 22.06,66.23
EZFET_XT2OUT
  Top 0.203: MSP101.58 24.79,67.27 24.79,64.9 24.2,64.31
  Top 0.406: Q101.3 24.2,64.05 24.2,64.31
GND  (via drill 0.3)
  Top 0.152: v25.17,77.34 25.17,75.56 25.43,75.31 MSP101.39 | MSP102.TP 38.76,78.49 39.14,78.87 MSP102.14 | 26.79,70.14 26.82,70.1 MSP101.TP 27.2,70.74
  Top 0.203: 33.63,71.4 33.53,71.4 | 33.63,71.4 33.63,71.39 MSP101.16 | MSP101.56 24.83,68.75 | MSP101.39 25.93,74.85 25.93,74.7 25.75,74.52 | MSP101.14 32.79,70.81 32.79,71.14 33.1,71.48 33.53,71.48 33.63,71.4 | C101.2 34,74.79 v33.91,74.88
  Top 0.254: 24.83,68.75 24.86,68.75 25.12,69.01 v25.12,70.26 | Q101.2 22.95,64.99 21.61,63.65 | C121.2 32.94,67.41 33.43,66.93
  Top 0.305: 21.61,63.65 18.45,63.63 C102.2
  Bottom 0.203: v20.68,64.41 21.23,64.41 21.72,64.9
  other vias: 10.57,67.82 8.89,68.83 51.08,82.3 41.45,78.87 24.18,66.78 35.33,71.37 19.96,82.55 23.01,75.44 53.49,63.45 43.69,80.04 46.18,66.78 45.75,68.61 47.83,76.33 44.09,73.28 52.7,81.03 17.25,80.14 47.07,82.55 35.59,72.54 48.34,71.12 49.1,74.96 8.43,64.72 16.59,66.07 25.17,78.97 28.85,79.98 17.07,64.85 22.35,62.97 18.95,66.62 27.41,67.46 30.66,73.66 12.22,62.23 22.12,79.65 5.18,72.64 5.23,76.33 16.66,82.42 5.79,79.6 15.72,74.57 13.49,69.34 11.66,74.63 14.88,77.34 16.1,70.48 8.41,71.37 11.45,76.58 27.69,63.91 47.8,72.24 38.4,70.61 41.6,74.24 42.49,67.94 49.76,79.2 21.61,73.53 41.81,71.09 7.9,62.1 1.17,63.37 1.17,72.26 1.17,77.72 21.74,82.55 57.2,60.76 57.48,69.06 57.53,73.66 57.53,77.67 54.69,77.04 56.44,67.18 54.64,60.07 25.43,59.82 30.12,57.66 15.77,59.82 25.91,62.59 6.04,67.18 19.15,73.28 17.3,67.94 26.59,72.14 28.19,70.46 38.15,77.6 39.42,76.71 21.49,71.63 7.21,73.99 12.85,76.58 13.36,72.64 28.9,73.89 53.64,72.67 37.72,69.9 34.04,66.6 52.86,60.5 49.02,67.06 54.05,66.55 50.06,60.91 53.44,65.58 45.67,62.97 51.26,71.12 28.88,75.44 36.12,80.77 42.24,64.74 37.11,61.21 45.39,62.05 42.75,62.18 29.64,63.3 33.96,62.56 31.52,62.48 35.71,60.71
  pour Top: 0.02,57.4 58.45,57.4 58.45,83.82 0.02,83.82
  pour Bottom: 0.02,57.4 58.45,57.4 58.45,83.82 0.02,83.82
  pour MidBottom: 0.02,83.82 58.45,83.82 58.45,57.4 0.02,57.4
N$2
  Top 0.305: R1.2 19.96,40.01 C13.1 24.48,40.1 MSP1.80
N$3
  Top 0.508: J8.2 C1.+
N$4
  Top 0.254: R4.2 36.81,3.3 LED2.A
N$5
  cutout MidBottom: 25.3,38.99 25.3,40.51 24.92,40.89 23.14,40.89 21.87,42.16 21.87,48.01 22.63,48.77 36.09,48.77 37.62,47.24 37.62,43.69 35.59,41.66 28.73,41.66 27.71,40.64 27.71,39.12 27.46,38.86 25.43,38.86
  cutout Top: 25.3,38.99 25.3,40.51 24.92,40.89 23.14,40.89 21.87,42.16 21.87,48.01 22.63,48.77 36.09,48.77 37.62,47.24 37.62,43.69 35.59,41.66 28.73,41.66 27.71,40.64 27.71,39.12 27.46,38.86 25.43,38.86
  cutout MidTop: 25.3,38.99 25.3,40.51 24.92,40.89 23.14,40.89 21.87,42.16 21.87,48.01 22.63,48.77 36.09,48.77 37.62,47.24 37.62,43.69 35.59,41.66 28.73,41.66 27.71,40.64 27.71,39.12 27.46,38.86 25.43,38.86
  cutout Bottom: 25.3,38.99 25.3,40.51 24.92,40.89 23.14,40.89 21.87,42.16 21.87,48.01 22.63,48.77 36.09,48.77 37.62,47.24 37.62,43.69 35.59,41.66 28.73,41.66 27.71,40.64 27.71,39.12 27.46,38.86 25.43,38.86
N$6
  Top 0.254: 15.27,5.29 arc-90 R3.1 15.27,5.29 | J7.2 15.27,5.29
N$7
  Top 0.254: LED1.A 13.88,3.56 R3.2
N$8
  Top 0.254: MSP1.78 25.48,40.58 23.06,43 Q1.2 23.14,43.76 C7.1
N$9
  Top 0.203: 32.66,79.12 32.82,79.27 | 32.82,79.27 32.92,79.38 | R101.1 32.66,79.38 | 32.66,79.38 | 32.82,79.27 LED101.A 32.66,79.36 32.66,79.38
N$10
  Top 0.254: MSP1.74 27.48,41.18 28.47,42.16 31.52,42.16 32.79,43.43 32.79,44.7 | 32.79,44.7 33.05,44.7 | 33.05,44.7 Q2.2 | 33.21,44.74 33.05,44.7 | C9.1 34.15,47.34 32.79,45.97 32.79,44.7
N$11
  Top 0.254: MSP1.75 26.98,41.44 28.22,42.67 30.25,42.67 30.76,43.18 30.76,44.7 | 30.76,44.7 Q2.1 | 30.34,45.12 30.63,44.83 | 30.63,44.83 30.76,44.7 | C8.1 29.4,47.34 30.76,45.97 30.76,44.96 30.63,44.83
N$12
  Top 0.305: T102.2 46.78,71.49 46.76,71.5 45.87,71.5 45.53,71.84 R119.1
N$13
  Top 0.254: T102.1 D101.2 D101.1 46.27,76.98 45.87,76.58 44.98,76.58 R118.1
  Top 0.305: R118.1 44.79,76.59
N$14
  Top 0.254: MSP1.77 25.98,41.1 24.97,42.11 Q1.1 24.92,43.74 C6.1
N$15
  Top 0.635: L101.1 53.23,68.74 53.23,68.83 | 53.23,68.83 53.24,69.85 53.24,70.36 52.48,71.12 T101.3 | D102.3 48.68,69.1 49.17,69.6 52.35,69.6 53.11,68.83 53.23,68.83
N$16
  Top 0.203: T102.3 48.8,72.13 48.29,72.64 48.29,75.82 48.79,76.33 49.68,76.33 49.96,76.05 R120.2 | T101.1 50.38,71.82 50.06,72.14 T102.3 | 48.79,72.14 T102.3
  Top 0.406: 48.79,76.33 D101.3
N$17
  Top 0.508: R6.2 44.86,17.78 J8.3
N$20
  Top 0.203: R102.1 32.14,80.5 32.73,81.09 | 32.73,81.09 32.79,81.15 | LED102.A 32.76,81.06 32.73,81.09
P1.0_LED1
  Top 0.254: MSP1.1 24.48,37.77 25.93,36.32 25.93,28.96 14.76,17.78 14.76,10.67 J7.1
P1.1_LED2  (via drill 0.3)
  Top 0.254: MSP1.2 24.22,37.27 25.43,36.07 25.43,29.21 13.74,17.53 v13.74,13.72 | v44.48,4.57 44.48,3.57 R4.1
  Bottom 0.254: v13.74,13.72 14.25,13.72 18.57,9.4 39.65,9.4 v44.48,4.57
P1.2_A2_J1.2
  Top 0.305: MSP1.3 18.63,36.77 13.49,41.91 7.65,41.91 J1.2
P1.3_A3_J1.6
  Top 0.305: MSP1.16 11.16,30.27 9.68,31.75 7.65,31.75 J1.6
P1.4_A4_J3.27
  Top 0.305: MSP1.17 9.62,29.77 J3.27
P1.5_A5_J3.28
  Top 0.305: MSP1.18 10.25,29.27 J3.28
P1.6_SD_MOSI  (via drill 0.3)
  Top 0.254: SD1.3 26.12,17.72 v26.44,18.03 | v28.47,22.1 v28.47,24.38 | v30,31.24 32.03,33.27 MSP1.51
  Bottom 0.254: v26.44,18.03 27.2,18.03 28.73,19.56 28.73,21.84 v28.47,22.1 | v28.47,24.38 28.47,25.65 29.49,26.67 29.49,30.73 v30,31.24
P1.7_SD_MISO  (via drill 0.3)
  Top 0.254: MSP1.52 28.97,33.77 27.46,32.26 27.46,28.45 v27.71,28.19 | v24.92,23.62 22.38,23.62 21.61,22.86 21.61,16.91 SD1.7
  Bottom 0.254: v27.71,28.19 27.71,26.92 24.92,24.13 v24.92,23.62
P2.0_BCLUART_TXD  (via drill 0.3)
  Top 0.254: J101.6 40.16,54.1 40.16,43.94 v39.65,43.43 | v32.54,29.72 33.98,28.27 MSP1.41
  Bottom 0.254: v39.65,43.43 38.38,43.43 34.06,39.12 33.05,39.12 31.52,37.59 31.52,30.73 v32.54,29.72
P2.1_BCLUART_RXD  (via drill 0.3)
  Top 0.254: J101.8 39.4,44.45 38.89,43.94 v38.89,42.42 | v33.81,29.72 34.76,28.77 MSP1.42
  Bottom 0.254: v38.89,42.42 37.87,41.4 37.11,41.4 34.06,38.35 33.3,38.35 32.28,37.34 32.28,31.24 v33.81,29.72
P2.2_SD_SPICLK  (via drill 0.3)
  Top 0.254: MSP1.43 35.27,29.27 34.06,30.48 28.98,30.48 28.47,29.97 v28.47,28.96 | SD1.5 23.93,18.01 22.12,19.81 22.12,22.5 22.48,22.86 25.43,22.86 v26.95,24.38
  Bottom 0.254: v28.47,28.96 28.47,26.67 26.95,25.15 v26.95,24.38
P2.5_IO_J4.34  (via drill 0.3)
  Top 0.254: MSP1.35 31.48,23.4 32.54,22.35 42.95,22.35 44.73,24.13 44.73,27.69 v46,28.96
  Bottom 0.254: v46,28.96 48.03,28.96 J4.34
P2.6_CAPTURE_J4.35  (via drill 0.3)
  Top 0.254: MSP1.36 31.98,23.67 32.79,22.86 42.7,22.86 44.22,24.38 44.22,28.19 v44.98,28.96
  Bottom 0.254: v44.98,28.96 45.75,29.72 46.76,29.72 49.55,32.51 J4.35
P3.0_A12_J3.23
  Top 0.305: MSP1.4 18.11,36.27 13.74,40.64 J3.23
P3.1_A13_J3.24
  Top 0.305: MSP1.5 17.59,35.77 15.27,38.1 J3.24
P3.2_A14_J3.25
  Top 0.254: 17.33,35.27 16.28,36.32 9.68,36.32 J3.25
  Top 0.305: MSP1.6 17.33,35.27
P3.3_A15_J3.26
  Top 0.305: MSP1.7 17.07,34.77 16.03,35.81 11.71,35.81 J3.26
P3.4_PWM_J4.37
  Top 0.254: MSP1.47 44.5,31.27 47.78,34.54 47.78,36.32 J4.37
P3.5_PWM_J4.38
  Top 0.254: MSP1.48 44.24,31.77 47.27,34.8 47.27,38.35 J4.38
P3.6_PWM_J4.39
  Top 0.254: MSP1.49 43.98,32.27 46.76,35.05 46.76,40.39 J4.39
P3.7_PWM_J4.40
  Top 0.254: MSP1.50 43.72,32.77 46.25,35.31 46.25,42.42 J4.40
P4.0_SD_CS
  Top 0.254: SD1.2 27.22,17.66 R5.1 28.84,18.91 29.48,19.55 MSP1.31
P4.1_IO_J4.31
  Top 0.254: MSP1.32 29.98,22.62 31.78,20.83 43.71,20.83 45.75,22.86 J4.31
P4.2_IO_J4.32  (via drill 0.3)
  Top 0.254: MSP1.33 30.48,22.88 32.03,21.34 43.46,21.34 45.75,23.62 45.75,24.89 v46.25,25.4
  Bottom 0.254: v46.25,25.4 J4.32
P4.3_IO_J4.33  (via drill 0.3)
  Top 0.254: 46,27.94 v46.25,27.94 45.24,26.92 45.24,23.88 43.21,21.84 32.28,21.84 30.98,23.14 MSP1.34
  Bottom 0.254: v46.25,27.94 J4.33
P4.4_IO_J2.18  (via drill 0.3)
  Top 0.254: MSP1.57 43.66,36.27 v44.98,37.59
  Bottom 0.254: v44.98,37.59 46.76,39.37 50.83,39.37 J2.18
P4.7_IO_J3.29  (via drill 0.3)
  Top 0.254: MSP1.12 15.25,32.27 v14.76,32.77 | v14.5,26.67 10.18,26.67 J3.29
  Bottom 0.254: v14.76,32.77 14.76,26.92 v14.5,26.67
P5.0_SPIMOSI_J2.15  (via drill 0.3)
  Top 0.254: MSP1.53 43.95,34.27 v44.22,34.54
  Bottom 0.254: v44.22,34.54 44.48,34.29 50.83,34.29 J2.15
P5.1_SPIMISO_J2.14  (via drill 0.3)
  Top 0.254: MSP1.54 42.67,34.77 v42.95,35.05 | v48.03,32.77 48.03,32.26 48.54,31.75 50.83,31.75 J2.14
  Bottom 0.254: v42.95,35.05 42.95,34.54 43.97,33.53 47.27,33.53 v48.03,32.77
P5.2_SPICLK_J1.7  (via drill 0.3)
  Top 0.254: v27.96,34.04 29.2,35.27 MSP1.55
  Bottom 0.254: J1.7 6.88,30.48 8.15,31.75 11.45,31.75 13.23,33.53 14.25,33.53 14.76,34.04 v27.96,34.04
P5.3_IO_J2.17  (via drill 0.3)
  Top 0.254: MSP1.56 44.69,35.77 v45.24,36.32
  Bottom 0.254: v45.24,36.32 48.29,36.32 48.79,36.83 50.83,36.83 J2.17
P5.5_BUTTON2  (via drill 0.3)
  Top 0.254: MSP1.66 31.48,38.32 v30.76,37.59
  Bottom 0.254: v30.76,37.59 30.76,25.15 35.59,20.32 49.56,20.32 S2.1
P5.6_BUTTON1  (via drill 0.3)
  Top 0.254: MSP1.67 30.98,38.83 30.76,38.61 30.5,38.61 v29.49,37.59
  Bottom 0.254: v29.49,37.59 29.49,32 15.27,17.78 S1.1
P5.7_PWM_J2.19  (via drill 0.3)
  Top 0.254: MSP1.68 30.48,40.62 30.76,40.89 35.33,40.89 36.09,41.66 v45.24,41.66
  Bottom 0.254: v45.24,41.66 45.49,41.91 50.83,41.91 J2.19
P6.0_UTXD_J1.4  (via drill 0.3)
  Top 0.254: J1.4 7.65,36.83 9.68,36.83 10.18,37.34 v14.25,37.34 | MSP1.8 16.94,34.27 16.15,35.05 v14.76,35.05
  Bottom 0.254: v14.76,35.05 14.76,36.83 v14.25,37.34
P6.1_URXD_J1.3  (via drill 0.3)
  Top 0.254: MSP1.9 16.8,33.77 16.28,34.29 14,34.29 v13.74,34.54 | J1.3 7.65,39.37 12.73,39.37 v13.23,38.86
  Bottom 0.254: v13.74,34.54 13.74,36.32 13.23,36.83 v13.23,38.86
P6.2_IO_J1.5  (via drill 0.3)
  Top 0.254: MSP1.10 16.54,33.27 16.03,33.78 11.2,33.78 v10.95,34.04
  Bottom 0.254: v10.95,34.04 10.69,34.29 7.65,34.29 J1.5
P6.3_IO_J1.8  (via drill 0.3)
  Top 0.254: MSP1.11 16.02,32.77 v15.77,33.02 | v15.52,27.43 10.18,27.43 9.42,26.67 7.65,26.67 J1.8
  Bottom 0.254: v15.77,33.02 15.77,27.69 v15.52,27.43
P7.0_I2CSDA_J1.10  (via drill 0.3)
  Top 0.254: MSP1.13 13.98,31.77 v13.74,32
  Bottom 0.254: v13.74,32 13.74,25.65 9.68,21.59 7.65,21.59 J1.10
P7.1_I2CSCL_J1.9  (via drill 0.3)
  Top 0.254: MSP1.14 12.95,31.27 v12.73,31.5 | v11.2,24.13 7.65,24.13 J1.9
  Bottom 0.254: v12.73,31.5 12.73,25.65 v11.2,24.13
P7.2_SD_DETECT
  Top 0.254: SD1.B 17.8,6.67 17.8,10.92 16.54,12.19 R7.2 16.17,13.07 15.52,13.72 15.52,17.53 22.5,24.51 25.81,24.51 26.48,25.19 MSP1.25
P7.3_CAPTURE_J4.36  (via drill 0.3)
  Top 0.254: v42.7,37.08 v37.87,37.08 | MSP1.26 26.98,35.34 28.47,36.83 v33.55,36.83
  Bottom 0.254: J4.36 44.22,35.56 v42.7,37.08 | v37.87,37.08 33.81,37.08 v33.55,36.83
P8.0_IO_J3.30  (via drill 0.3)
  Top 0.254: MSP1.15 11.93,30.77 v11.71,30.99
  Bottom 0.254: v11.71,30.99 11.71,25.65 J3.30
P8.1_IO_J2.11
  Top 0.254: MSP1.44 46.2,29.77 47.52,28.45 47.52,25.4 48.79,24.13 50.83,24.13 J2.11
P8.2_IO_J2.12
  Top 0.254: MSP1.45 46.46,30.27 48.03,28.7 48.03,27.43 48.79,26.67 50.83,26.67 J2.12
P8.3_IO_J2.13
  Top 0.254: MSP1.46 46.73,30.77 48.29,29.21 50.83,29.21 J2.13
TEST/SBWTCK  (via drill 0.3)
  Top 0.254: MSP1.37 32.48,23.93 33.05,23.37 42.19,23.37 v42.44,23.62 | v53.62,24.13 57.18,27.69 57.18,52.83 55.65,54.36 48.54,54.36 J101.2
  Bottom 0.254: v42.44,23.62 47.78,23.62 48.29,24.13 v53.62,24.13
TGT_GND  (via drill 0.3)
  Top 0.254: MSP1.79 24.98,38.54 25.17,38.35 v25.81,38.35 26.31,38.35 26.48,38.52 MSP1.76 | MSP1.73 27.98,38.76 v27.58,38.35 | MSP1.39 33.48,27.63 v33.43,27.69 | MSP1.60 36.4,37.77 v36.98,38.35 36.35,38.99 C4.2 | C7.2 23.14,47.12 | C6.2 24.92,47.12 | MSP1.19 23.33,28.77 v24.03,29.46
  Top 0.61: C9.2 v31.78,47.88 C8.2 | 23.14,47.12 v24.03,48.01 24.92,47.12
  MidBottom 0.203: v31.78,47.88 v31.78,49.4 | v24.03,48.01 v24.03,49.53
  other vias: 13.23,52.58 17.2,2.03 30.02,51.44 8.15,8.64 8.15,6.35 8.15,3.81 7.26,11.3 11.2,10.41 11.96,6.35 20.6,14.73 33.55,1.91 19.33,42.04 18.95,38.61 24.28,19.05 18.95,25.91 37.49,25.65 38.4,52.7 37.64,48.9 19.86,50.93 26.47,55.24 23.27,20.07 22.76,18.03 30.12,14.73 25.3,4.57 51.87,55.5 42.98,51.94 53.64,51.44 40.94,39.24 11.73,48.9 1.83,54.23 3.35,41.53 3.35,29.08 2.08,7.49 12.5,20.45 31.55,18.92 55.93,10.03 55.42,31.62 55.17,41.78 41.2,27.81
  pour Top: 0.02,56.64 0.02,0 58.45,0 58.45,56.64
  pour MidBottom: 0.02,56.64 0.02,0 58.45,0 58.45,56.64
  pour Bottom: 0.02,56.64 0.02,0 58.45,0 58.45,56.64

## Text on the board
tPlace: RST | P5.6 | P5.5 | P1.0 | P1.1
tNames: microSD
tDocu: IC103 | eZ-FET Rev1.3 | Rev1.1 | MSP430FR5994 | MSP-EXP430FR5994 | RXD << | TXD >> | SBWTDIO | SBWTCK | P3.7 | P1.2 | P3.6 | P5.7 | P6.1 | P3.5 | P3.0 | P4.4 | P6.0 | P3.4 | P3.1 | P5.3 | P6.2 | P7.3 | P3.2 | !RST | P1.3 | P2.6 | P3.3 | P5.0 | P5.2 | P2.5 | P1.4 | P5.1 | P6.3 | P4.3 | P1.5 | P8.3 | P7.1 | P4.2 | P4.7 | P8.2 | P7.0 | P4.1 | P8.0 | P8.1 | Supercap C1 | Use | Charge
tSilk: J | C